# EAGLE design fonte12v (EAGLE 9.4.1)
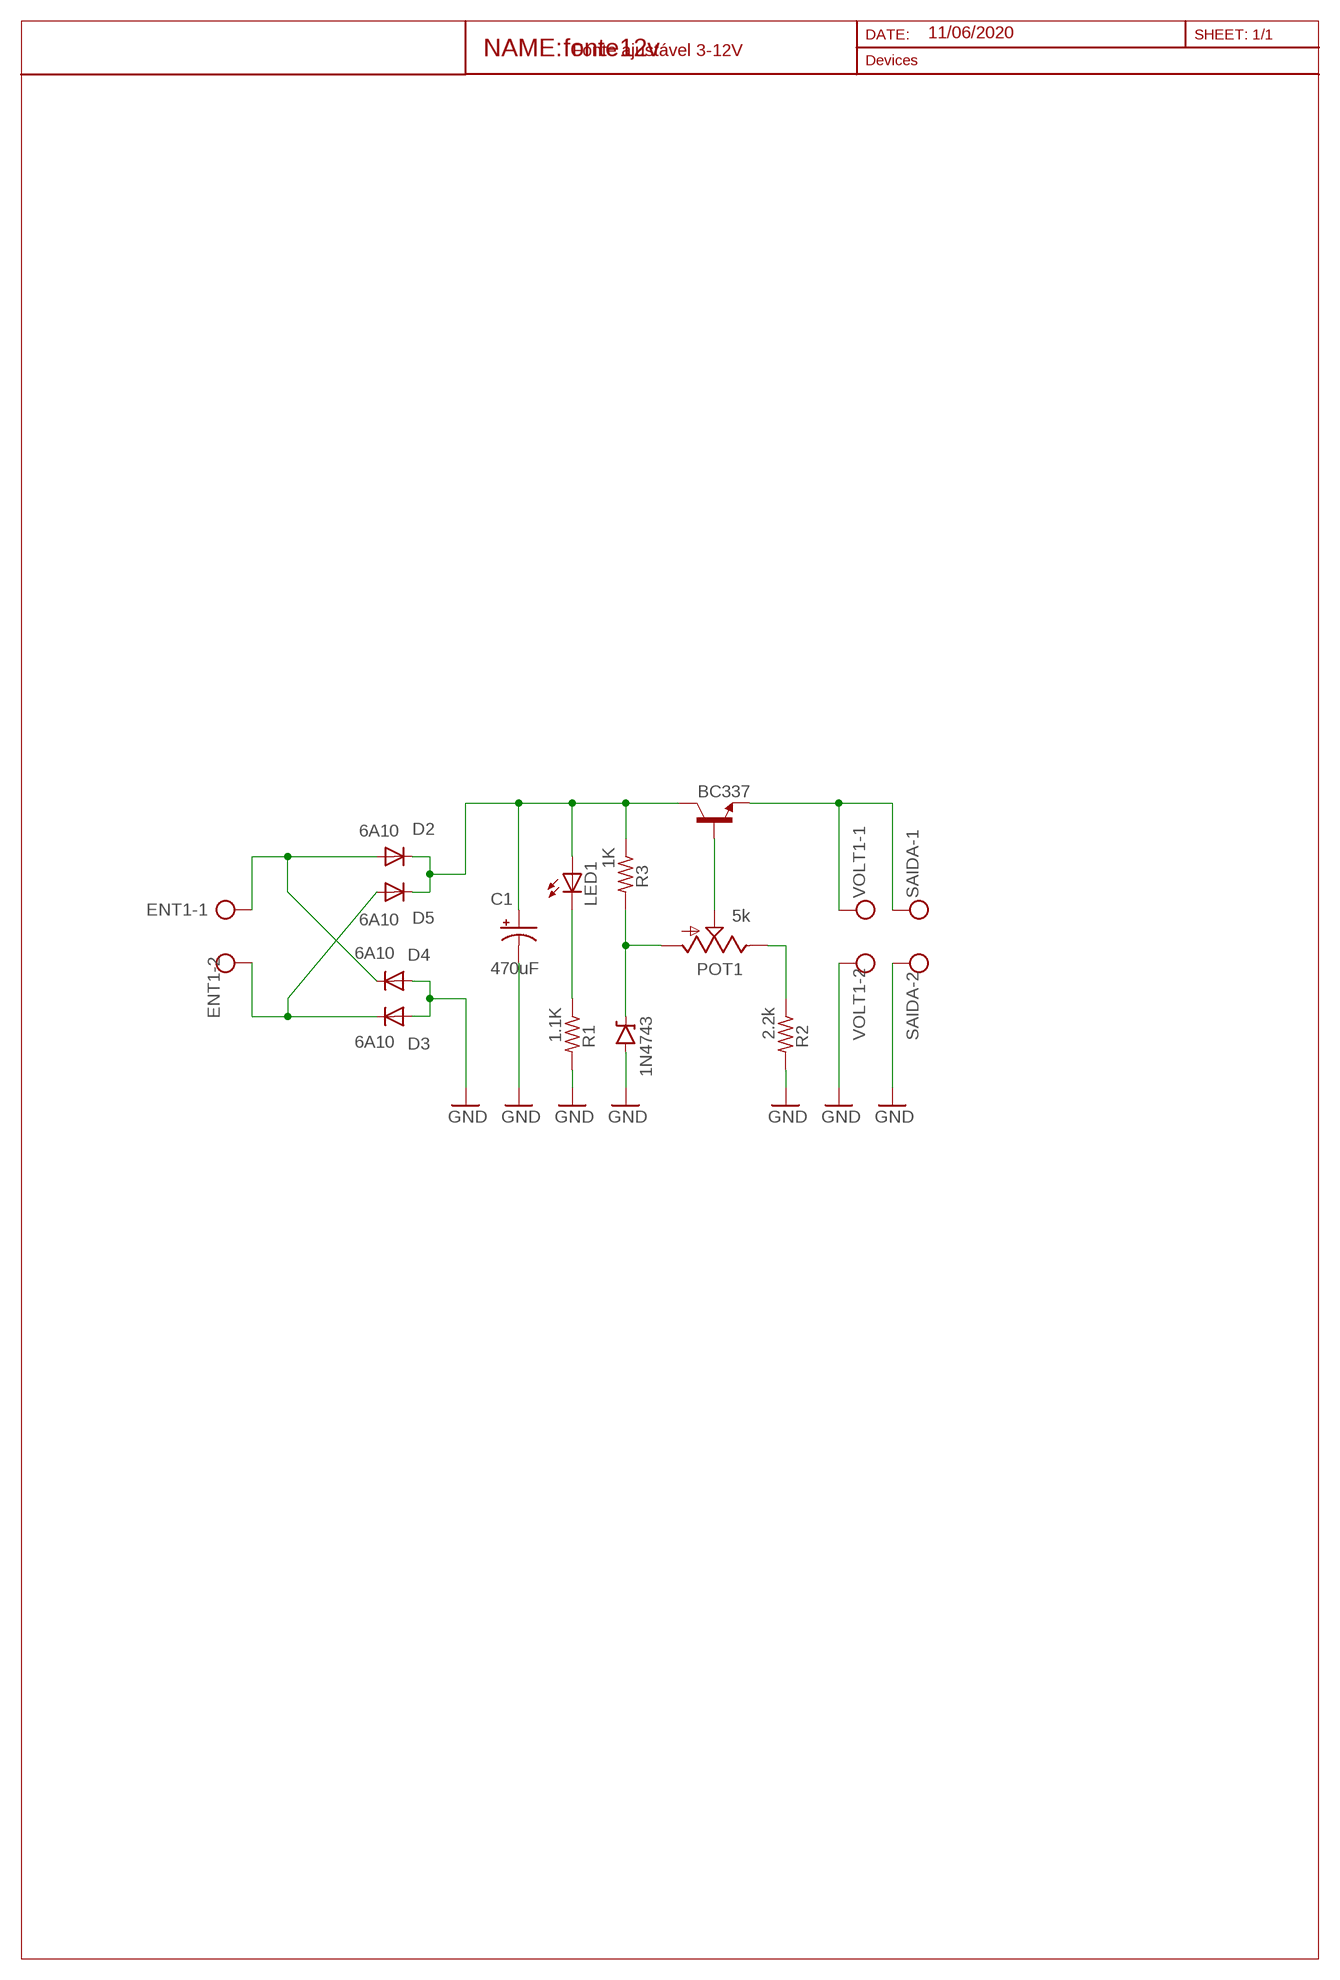
[diagram p0: schematic, sheet 1]

## Parts
1N4743  BZT52  DIODE-ZENER  [DIODE-BZT52]
C1  470uF  CPOL-USE5-13  [E5-13]
D2  6A10  1N4004  [DO41-10]
D3  6A10  1N4004  [DO41-10]
D4  6A10  1N4004  [DO41-10]
D5  6A10  1N4004  [DO41-10]
ENT1  AK500/2-H  [AK500/2-H]
LED1  LED5MM  [LED5MM]
POT1  5k  POT  [ALPS_POT]
R1  1.1K  FLIPFLOP-RES  [0805-THM]
R2  2.2k  FLIPFLOP-RES  [0805-THM]
R3  1K  FLIPFLOP-RES  [0805-THM]
SAIDA  AK500/2-H  [AK500/2-H]
T1  BC337  [TO92]
VOLT1  AK500/2-H  [AK500/2-H]

## Nets
GND: 1N4743.A C1.- D3.A D4.A R1.2 R2.2 SAIDA.2 VOLT1.2
N$1: POT1.P$2(S) T1.2(B)
N$2: LED1.K(C) R1.1
N$3: POT1.P$1(E) R2.1
N$5: SAIDA.1 T1.1(E) VOLT1.1
N$6: 1N4743.C POT1.P$3(A) R3.2
N$7: D3.C D5.A ENT1.2
N$11: D2.A D4.C ENT1.1
N$13: C1.+ D2.C D5.C LED1.A R3.1 T1.3(C)

## Notes on the sheet
- 11/06/2020
- Fonte ajustável 3-12V

## Library data of the parts
1N4743 = SparkFun-DiscreteSemi:DIODE-ZENER: Zener Diode Production Part - 8199 3.4V Zener Voltage; PROD-ID: DIO-08199
C1 = adafruit:CPOL-US: POLARIZED CAPACITOR, American symbol
D2-D5 = adafruit:1N4004: DIODE General purpose 1N400x type rectifier (With bigger pads) http://www.ladyada.net/library/pcb/eaglelibrary.html
ENT1 SAIDA VOLT1 = con-ptr500:AK500/2-H: CONNECTOR Aug. 2004 / PTR Meßtechnik: Die Bezeichnung der Serie AK505 wurde geändert. Es handelt sich hierbei um AK500 in horizontaler Ausführung.; OC_FARNELL: unknown; OC_NEWARK: unknown
LED1 = adafruit:LED: LED OSRAM: - CHIPLED LG R971, LG N971, LY N971, LG Q971, LY Q971, LO R971, LY R971 LH N974, LH R974 LS Q976, LO Q976, LY Q976 LO Q996 - Hyper CHIPLED LW Q18S LB Q993, LB Q99A, LB R99A - SideLED LS A670, LO A670, LY A670, LG A670, LP A670 LB A673, LV A673, LT A673, LW A673 LH A674 LY A675 LS A676, LA A676, LO A676, LY A676, LW A676 LS A679, LY A679, LG A679 - Hyper Micro SIDELED® LS Y876, LA Y876, LO Y876, LY Y876 LT Y87S - SmartLED LW L88C, LW L88S LB L89C, LB L89S, LG L890 LS L89K, LO L89K, LY L89K LS L896, LA L896, LO L896, LY L896 - TOPLED LS T670, LO T670, LY T670, LG T670, LP T670 LSG T670, LSP T670, LSY T670, LOP T670, LYG T670 LG T671, LOG T671, LSG T671 LB T673, LV T673, LT T673, LW T673 LH T674 LS T676, LA T676, LO T676, LY T676, LB T676, LH T676, LSB T676, LW T676 LB T67C, LV T67C, LT T67C, LS T67K, LO T67K, LY T67K, LW E67C LS E67B, LA E67B, LO E67B, LY E67B, LB E67C, LV E67C, LT E67C LW T67C LS T679, LY T679, LG T679 LS T770, LO T770, LY T770, LG T770, LP T770 LB T773, LV T773, LT T773, LW T773 LH T774 LS E675, LA E675, LY E675, LS T675 LS T776, LA T776, LO T776, LY T776, LB T776 LHGB T686 LT T68C, LB T68C - Hyper Mini TOPLED® LB M676 - Mini TOPLED Santana® LG M470 LS M47K, LO M47K, LY M47K Source: http://www.osram.convergy.de/
POT1 = SparkFun-Electromechanical:POT; PROD_ID: RES-09177
R1-R3 = adafruit:FLIPFLOP-RES: Flip Flop resistor An 0805 resistor inside a standard 1/4W 5% resistor. Makes for easy mods
T1 = transistor:BC337: NPN TRANSISTOR

## Board
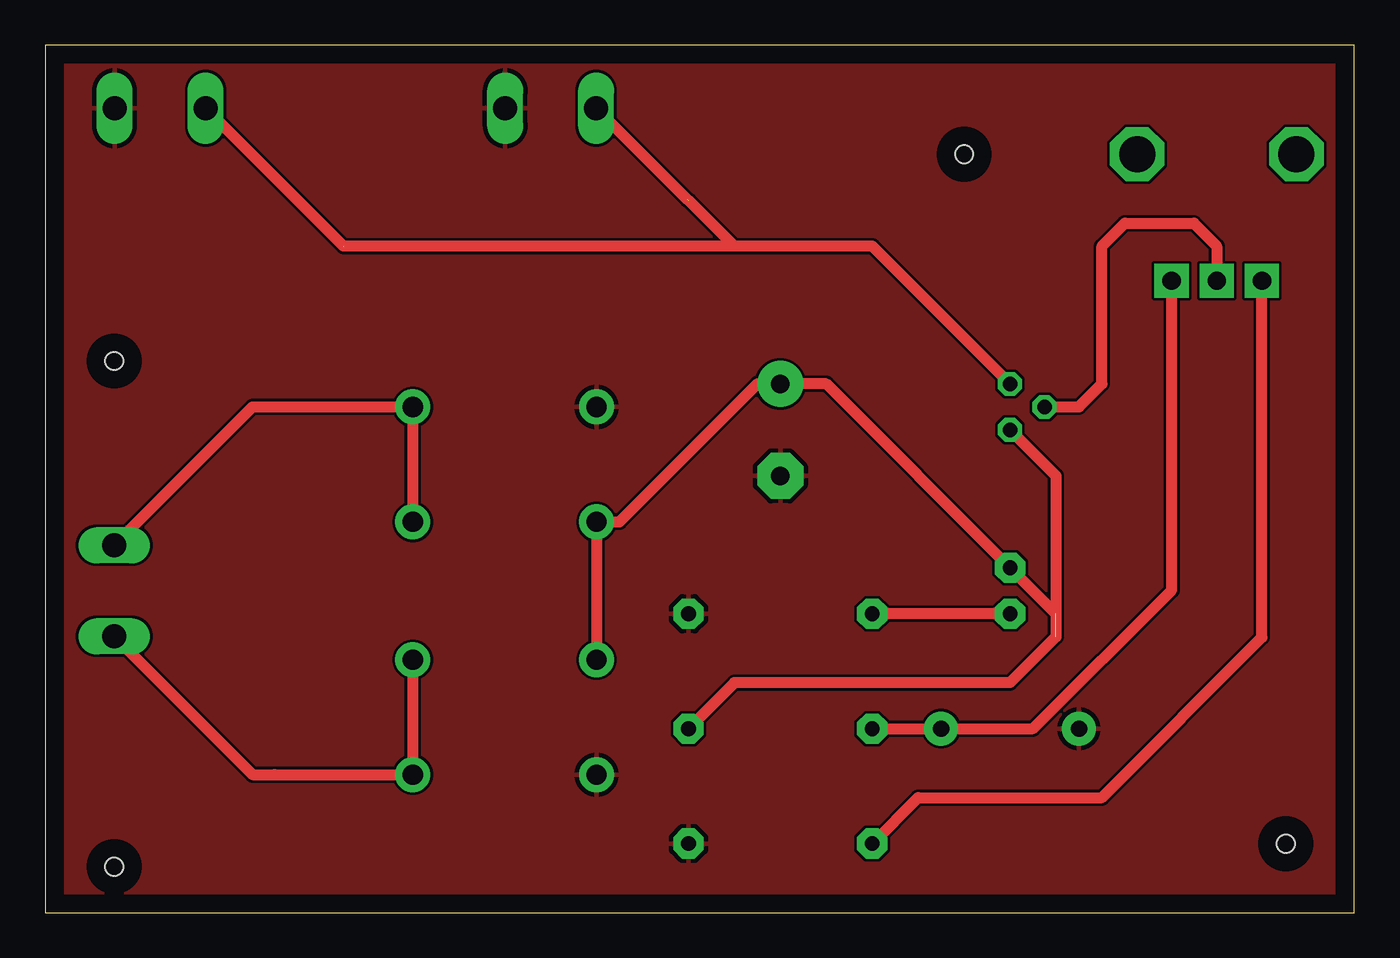
[diagram p1: board, top side]
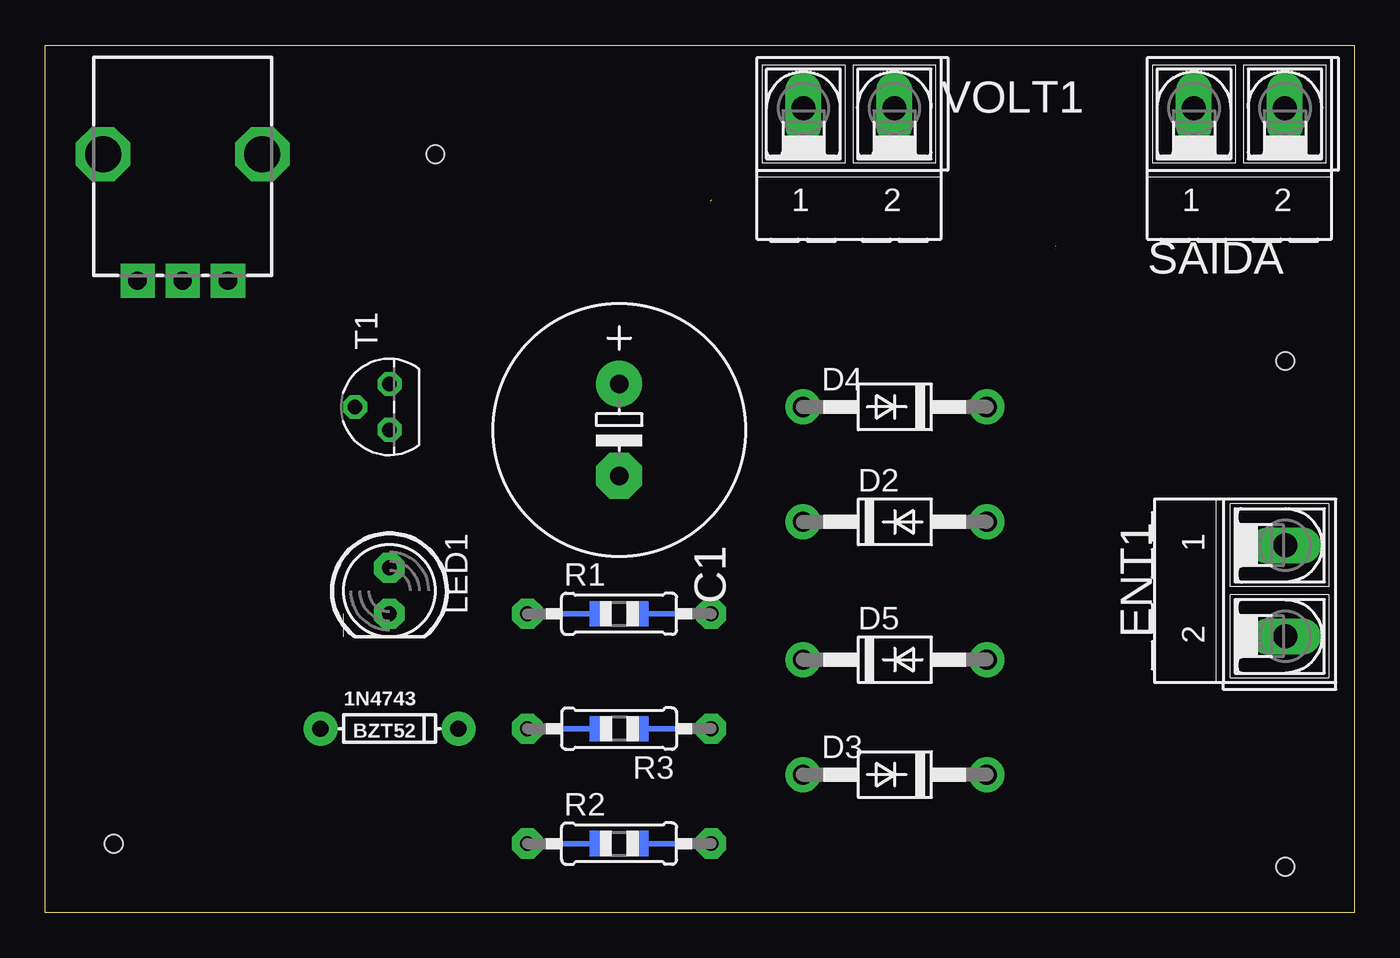
[diagram p2: board, bottom side, seen from below]

Size 72.37 x 47.93 mm. Coordinates in mm from the lower left corner, seen from the top.
Outline: 0,0 72.37,0 72.37,47.93 0,47.93 0,0
Copper layers (1*16): Top 0.035mm / dielectric 1.5mm / Bottom 0.035mm
Design rules "default": minimum track width 6mil, minimum drill 0.35mm, track to track 6mil, track to pad 6mil, pad to pad 6mil, via to via 6mil, smd to smd 6mil, copper to edge 40mil, drill to drill 6mil, minimum pad ring 10mil, minimum via ring 8mil, stop-mask expansion 4mil, vias tented up to drill 0mil, thermal gap 10mil
Holes 1 mm at 50.8,41.91 68.58,3.81 3.81,2.54 3.81,30.48

### Footprints (pad centres in the part's own frame; a part is rotated, then mirrored left to right if it is on the bottom)
DIODE-BZT52 = drill 0.9 pad 1.88: A -3.81,0; C 3.81,0
E5-13 = drill 1.016 pad 2.54: + -2.54,0 | drill 1.016 pad 2.54 octagon: - 2.54,0
DO41-10 = drill 1.118 pad 1.93: A 5.08,0; C -5.08,0
AK500/2-H = drill 1.321 long: 1 -2.515,0; 2 2.515,0
LED5MM = drill 0.813 pad 1.676 octagon: A -1.27,0; K 1.27,0
ALPS_POT = drill 1 pad 1.88 square: P$1 7,-2.5; P$2 7,0; P$3 7,2.5 | drill 2 octagon: P$4 0,-4.4; P$5 0,4.4
0805-THM = drill 0.813 pad 1.676 octagon: 1 -5.08,0; 2 5.08,0
TO92 = drill 0.813 octagon: 1 1.27,0; 2 0,1.905; 3 -1.27,0

### Placement (x,y rotation side)
1N4743  53.34,10.16 0 bottom
C1  40.64,26.67 270 bottom
D2  25.4,21.59 0 bottom
D3  25.4,7.62 180 bottom
D4  25.4,27.94 180 bottom
D5  25.4,13.97 0 bottom
ENT1  3.81,17.78 270 bottom
LED1  53.34,17.78 270 bottom
POT1  64.77,41.91 270 bottom
R1  40.64,16.51 0 bottom
R2  40.64,3.81 0 bottom
R3  40.64,10.16 180 bottom
SAIDA  6.35,44.45 0 bottom
T1  53.34,27.94 90 bottom
VOLT1  27.94,44.45 0 bottom

### Tracks (layer width: path | path; a pad name or v marks a point on that pad's centre or on a via)
GND
  pour Top: 72.39,0 72.39,48.26 0,48.26 0,0
N$1
  Top 0.61: T1.2 57.15,27.94 58.42,29.21 58.42,36.83 59.69,38.1 63.5,38.1 64.77,36.83 POT1.P$2
N$2
  Top 0.61: LED1.K R1.1
N$3
  Top 0.61: R2.1 48.26,6.35 58.42,6.35 67.27,15.2 POT1.P$1
N$5  (2 unrouted)
  Top 0.61: SAIDA.1 16.48,36.83 | 38.1,36.83 45.72,36.83 T1.1 | 38.1,36.83 16.54,36.83 | 35.58,39.34 38.1,36.83 | VOLT1.1 35.51,39.4
N$6
  Top 0.61: R3.2 1N4743.C 54.61,10.16 62.27,17.82 POT1.P$3
N$7
  Top 0.61: D5.A D3.C 12.7,7.62 | 12.68,7.62 12.7,7.62 | ENT1.2 11.46,7.62 12.7,7.62
N$11
  Top 0.61: D2.A D4.C 11.93,27.94 11.46,27.94 ENT1.1
N$13  (1 unrouted)
  Top 0.61: D5.C D2.C 31.75,21.59 39.37,29.21 C1.+ 43.18,29.21 LED1.A 55.88,16.51 | R3.1 38.1,12.7 53.34,12.7 55.88,15.24 55.88,24.13 T1.3